# Altium schematic sheet Main.SchDoc: =ProjectName
size A4; CheckedBy: DatNB; Author: Ven; CompanyName: Nacentech; Organization: IMET
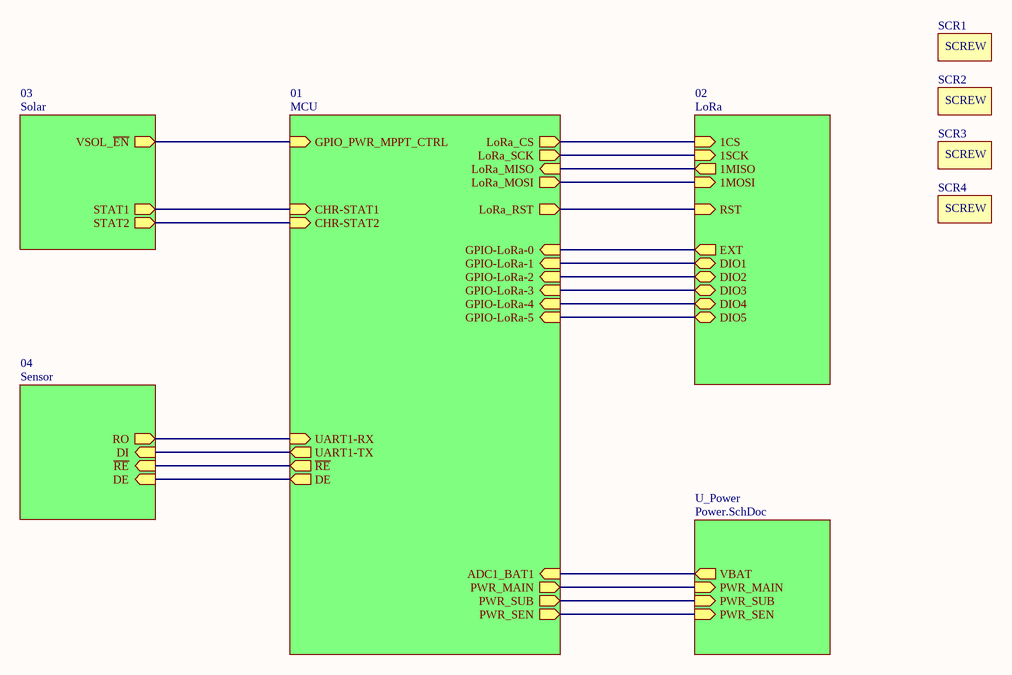
[diagram p0: Main.SchDoc]

## Parts
SCR1  Screw 3mm  [SCREW]  (value not drawn)
SCR2  Screw 3mm  [SCREW]  (value not drawn)
SCR3  Screw 3mm  [SCREW]  (value not drawn)
SCR4  Screw 3mm  [SCREW]  (value not drawn)

## Sub-sheets
01 = MCU: LoRa_MOSI (out), LoRa_MISO (in), CHR-STAT2 (in), CHR-STAT1 (in), UART1-TX (out), ADC1_BAT1 (in), LoRa_RST (out), LoRa_CS (out), UART1-RX (in), LoRa_SCK (out), GPIO_PWR_MPPT_CTRL (in), GPIO-LoRa-4 (in), GPIO-LoRa-1 (in), GPIO-LoRa-0 (in), GPIO-LoRa-3 (in), GPIO-LoRa-5 (in), GPIO-LoRa-2 (in), PWR_SEN (out), PWR_MAIN (out), PWR_SUB (out), DE (out), ~{RE} (out)
02 = LoRa: 1CS (in), 1MOSI (in), EXT (out), 1MISO (out), 1SCK (in), RST (in), DIO4 (bidir), DIO5 (bidir), DIO1 (bidir), DIO3 (bidir), DIO2 (bidir)
03 = Solar: STAT1 (out), STAT2 (out), VSOL_~{EN} (out)
04 = Sensor: RO (out), DI (in), ~{RE} (in), DE (in)
U_Power = Power.SchDoc: VBAT (out), PWR_SUB (in), PWR_MAIN (in), PWR_SEN (in)

## Nets
(unnamed): sheet 03/STAT1, sheet 01/CHR-STAT1
(unnamed): sheet 03/STAT2, sheet 01/CHR-STAT2
(unnamed): sheet 03/VSOL_~{EN}, sheet 01/GPIO_PWR_MPPT_CTRL
(unnamed): sheet 01/LoRa_MOSI, sheet 02/1MOSI
(unnamed): sheet 01/LoRa_MISO, sheet 02/1MISO
(unnamed): sheet 01/UART1-TX, sheet 04/DI
(unnamed): sheet 01/ADC1_BAT1, sheet U_Power/VBAT
(unnamed): sheet 01/LoRa_RST, sheet 02/RST
(unnamed): sheet 01/LoRa_CS, sheet 02/1CS
(unnamed): sheet 01/UART1-RX, sheet 04/RO
(unnamed): sheet 01/LoRa_SCK, sheet 02/1SCK
(unnamed): sheet 01/GPIO-LoRa-4, sheet 02/DIO4
(unnamed): sheet 01/GPIO-LoRa-1, sheet 02/DIO1
(unnamed): sheet 01/GPIO-LoRa-0, sheet 02/EXT
(unnamed): sheet 01/GPIO-LoRa-3, sheet 02/DIO3
(unnamed): sheet 01/GPIO-LoRa-5, sheet 02/DIO5
(unnamed): sheet 01/GPIO-LoRa-2, sheet 02/DIO2
(unnamed): sheet 01/PWR_SEN, sheet U_Power/PWR_SEN
(unnamed): sheet 01/PWR_MAIN, sheet U_Power/PWR_MAIN
(unnamed): sheet 01/PWR_SUB, sheet U_Power/PWR_SUB
(unnamed): sheet 01/DE, sheet 04/DE
(unnamed): sheet 01/~{RE}, sheet 04/~{RE}

Not connected (* = marked no-connect by the designer): SCR1 0; SCR2 0; SCR3 0; SCR4 0

## Notes on the sheet
- Project:
- Page Contents:
- Size:
- Date:
- A4
- Checked by:
- Time:
- Revision:
- Sheet
- of
- File:
- (in symbol screw3m) SCREW

## Library data of the parts
SCR1-SCR4 = screw3m